# Altium schematic sheet OLD.SchDoc: Pinger
size A4; Date: 05/06/2020; CompanyName: AUVIC; DrawnBy: Aman Nijjar; Engineer: Aman Nijjar; Organization: AUVIC; DocumentNumber: 1; Revision: 3; SheetNumber: 1; SheetTotal: 1
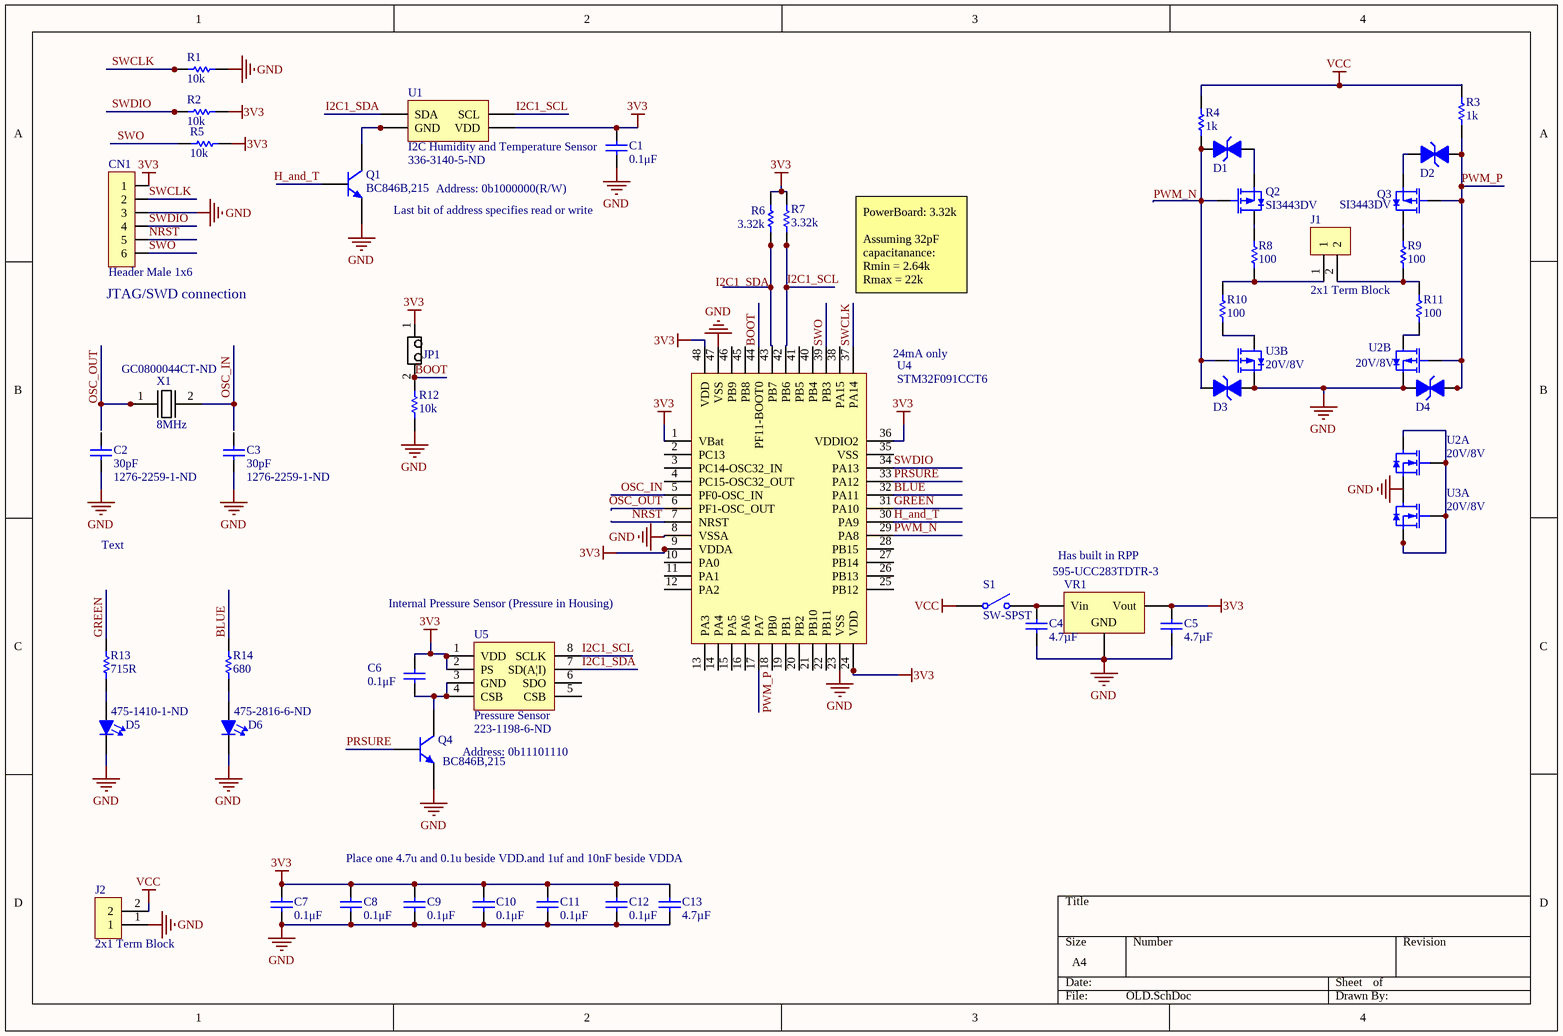
[diagram p0: OLD.SchDoc]

## Parts
C1  0.1μF  [CAPC1608N(0603")]
C2  30pF  Supplier Part Number 1: 1276-2259-1-ND  [CAPC1608N(0603")]
C3  30pF  Supplier Part Number 1: 1276-2259-1-ND  [CAPC1608N(0603")]
C4  4.7µF  [CAPC2012N(0805")]
C5  4.7µF  [CAPC2012N(0805")]
C6  0.1μF  [CAPC1608N(0603")]
C7  0.1μF  [CAPC1608N(0603")]
C8  0.1μF  [CAPC1608N(0603")]
C9  0.1μF  [CAPC1608N(0603")]
C10  0.1μF  [CAPC1608N(0603")]
C11  0.1μF  [CAPC1608N(0603")]
C12  0.1μF  [CAPC1608N(0603")]
C13  4.7µF  [CAPC2012N(0805")]
CN1  Header Male 1x6  [Header, Male, 1X6]
D1  SMBJ24CA  [DO-214AC]  (value not drawn)
D2  SMBJ24CA  [DO-214AC]  (value not drawn)
D3  SMBJ24CA  [DO-214AC]  (value not drawn)
D4  SMBJ24CA  [DO-214AC]  (value not drawn)
D5  Supplier Part Number 1: 475-1410-1-ND  [LED0805]  (hidden comment: Red)
D6  Supplier Part Number 1: 475-2816-6-ND  [LED0603]  (hidden comment: Blue)
J1  2x1 Term Block  [2X1 Terminal Blocks Phoenix Contact 5mm]
J2  2x1 Term Block  [2X1 Terminal Blocks]
JP1  1X2 Pin Head  [2X1 Males Header]  (value not drawn)
Q1  BC846B,215  [SOT-23]
Q2  SI3443DV  [SuperSOT-6]
Q3  SI3443DV  [SuperSOT-6]
Q4  BC846B,215  [SOT-23]
R1  10k  [RESC1608N(0603")]
R2  10k  [RESC1608N(0603")]
R3  1k  [RESC1608N(0603")]
R4  1k  [RESC1608N(0603")]
R5  10k  [RESC1608N(0603")]
R6  3.32k  [RESC1608N(0603")]
R7  3.32k  [RESC1608N(0603")]
R8  100  [RESC1608N(0603")]
R9  100  [RESC1608N(0603")]
R10  100  [RESC1608N(0603")]
R11  100  [RESC1608N(0603")]
R12  10k  [RESC1608N(0603")]
R13  715R  [RESC1608N(0603")]
R14  680  [RESC2012N(0805")]
S1  SW-SPST  [SPST-2]
U1  I2C Humidity and Temperature Sensor  Supplier Part Number 1: 336-3140-5-ND  [QFN-6]
U2  20V/8V  [SOT-363]  (parts A,B of 2)
U3  20V/8V  [SOT-363]  (parts A,B of 2)
U4  STM32F091CCT6  [STM-48LQFP]
U5  Pressure Sensor  Supplier Part Number 1: 223-1198-6-ND  [TE Pressure Sensor (MS560702BA03-50)]
VR1  595-UCC283TDTR-3  [D2PAK_N]
X1  8MHz  Supplier Part Number 1: GC0800044CT-ND  [HC49/US]

## Nets
3V3: C1.2(Cathode) C5.2(Cathode) C6.2(Cathode) C7.2(Cathode) C8.2(Cathode) C9.2(Cathode) C10.2(Cathode) C11.2(Cathode) C12.2(Cathode) C13.2(Cathode) CN1.1 JP1.1 R2.2 R5.2 R6.1 R7.1 U1.5(VDD) U4.1(VBat) U4.9(VDDA) U4.24(VDD) U4.36(VDDIO2) U4.48(VDD) U5.1(VDD) U5.2(PS) VR1.3(Vout)
GND: C1.1(Anode) C2.1 C3.1 C4.1(Anode) C5.1(Anode) C7.1(Anode) C8.1(Anode) C9.1(Anode) C10.1(Anode) C11.1(Anode) C12.1(Anode) C13.1(Anode) CN1.3 D3.2(Cathode) D4.2(Cathode) D5.1(Cathode) D6.1(Cathode) J2.1 Q1.2(E) Q4.2(E) R1.1 R12.1 U2.4(S2) U3.4(S2) U3.6(D1) U4.8(VSSA) U4.23(VSS) U4.47(VSS) VR1.2(GND)
VCC: J2.2 R3.2 R4.2 S1.1(COMMON)
BLUE: R14.2 U4.32(PA11)
BOOT: JP1.2 R12.2 U4.44(PF11-BOOT0)
GREEN: R13.2 U4.31(PA10)
H_and_T: Q1.1(B) U4.30(PA9)
I2C1_SCL: R7.2 U1.6(SCL) U4.42(PB6) U5.8(SCLK)
I2C1_SDA: R6.2 U1.1(SDA) U4.43(PB7) U5.7(SD(A|I))
NRST: CN1.5 U4.7(NRST)
OSC_IN: U4.5(PF0-OSC_IN) X1.2
OSC_OUT: U4.6(PF1-OSC_OUT) X1.1
PRSURE: Q4.1(B) U4.33(PA12)
PWM_N: D1.2(Cathode) D3.1(Anode) Q2.3 R4.1 U3.5(G2) U4.29(PA8)
PWM_P: D2.2(Cathode) D4.1(Anode) Q3.3 R3.1 U2.5(G2) U4.17(PA7)
SWCLK: CN1.2 R1.2 U4.37(PA14)
SWDIO: CN1.4 R2.1 U4.34(PA13)
SWO: CN1.6 R5.1 U4.39(PB3)
NetC4_2: C4.2(Cathode) S1.2(NO) VR1.1(Vin)
NetC6_1: C6.1(Anode) Q4.3(C) U5.3(GND) U5.4(CSB)
NetD1_1: D1.1(Anode) Q2.1
NetD2_1: D2.1(Anode) Q3.1
NetD5_2: D5.2(Anode) R13.1
NetD6_2: D6.2(Anode) R14.1
NetJ1_1: J1.1 R8.1 R10.2
NetJ1_2: J1.2 R9.1 R11.2
NetQ1_3: Q1.3(C) U1.2(GND)
NetQ2_4: Q2.4 R8.2
NetQ3_4: Q3.4 R9.2
NetR10_1: R10.1 U3.3(D2)
NetR11_1: R11.1 U2.3(D2)
NetU2_2: U2.2(G1) U2.6(D1) U3.1(S1) U3.2(G1)

Not connected (* = marked no-connect by the designer): C2 2; C3 2; U2 1(S1); U4 2(PC13) 3(PC14-OSC32_IN) 4(PC15-OSC32_OUT) 10(PA0) 11(PA1) 12(PA2) 13(PA3) 14(PA4) 15(PA5) 16(PA6) 18(PB0) 19(PB1) 20(PB2) 21(PB10) 22(PB11) 25(PB12) 26(PB13) 27(PB14) 28(PB15) 35(VSS) 38(PA15) 40(PB4) 41(PB5) 45(PB8) 46(PB9); U5 5(CSB) 6(SDO)

## Notes on the sheet
- Last bit of address specifies read or write
- Address: 0b1000000(R/W)
- (near CN1) JTAG/SWD connection
- PowerBoard: 3.32k
  Assuming 32pF capacitanance:
  Rmin = 2.64k
  Rmax = 22k
- (near U4) 24mA only
- Text
- Has built in RPP
- (near U4) Internal Pressure Sensor (Pressure in Housing)
- (near Q4) Address: 0b11101110
- Place one 4.7u and 0.1u beside VDD.and 1uf and 10nF beside VDDA

## Library data of the parts
C1 C6-C12 = 0.1uF 100V 0603 SMD, Ceramic: Capacitor, Ceramic, 100V, +/- 10%, 0603 SMD, X7R; MFG: TDK; MFG#: CGA3E3X7S2A104K080AB; Published: 16-04-26; Publisher: AUVic; PackageDescription: Chip Capacitor; Value: 0.1μF; Created By: Ashwin Sira; Supplier 1: Digi-Key; Supplier Part Number 1: 445-6938-1-ND
C2 C3 = 30pF 50V 0603 SMD, Ceramic: Capacitor, Ceramic, 50V, +/-1%, 0603 SMD, C0G; Made By: Andy Bates; Published: 16-09-12; Publisher: AUVic; PackageDescription: Chip Capacitor; Value: 30pF; Supplier 1: Digi-Key
C4 C5 C13 = 4.7uF 35V 0805 SMD, Ceramic: Capacitor, Ceramic, 35V, +/- 10%, 0805 SMD, X5R; Made By: Andy Bates; Published: 16-11-12; Publisher: AUVic; PackageDescription: Chip Capacitor; Value: 4.7µF; Supplier 1: Digi-Key; Supplier Part Number 1: 1276-6722-1-ND
CN1 = Header, Male, 1x6: 1x6, Pads Pitch: 0.1" (2.54mm), Through hole; Made Bates: Andy Bates; Supplier 1: Digikey; Supplier 1 Part Number: 952-2270-ND
D1-D4 = SMBJ24CA: TVS DIODE 24VWM 38.9VC SMB; Manufacturer: Fairchild Semiconductor; Type: Zener; Bidirectional Channels: 1; Voltage - Reverse Standoff (Typ): 24V; Voltage - Breakdown (Min): 26.7V; Voltage - Clamping (Max) @ Ipp: 38.9V; Current - Peak Pulse (10/1000µs): 15.4A; Power - Peak Pulse: 600W; Power Line Protection: No; Supplier 1: Digi-Key; Manufacturer Part Number: SMBJ24CA; RoHS: RoHS Compliant; Category: Circuit Protection; Stock 1: 31873; Pricing 1: 1=0.58, 10=0.411, 25=0.3372, 100=0.2695, 250=0.19636, 500=0.15946, 1000=0.12257 (USD); Packaging: Cut Tape (CT); Unidirectional Channels: -; Applications: General Purpose; Capacitance @ Frequency: -; Operating Temperature: -55°C ~ 150°C (TJ); Mounting Type: Surface Mount; Package / Case: DO-214AA, SMB; Supplier Device Package: DO-214AA (SMB); ComponentLink1URL: http://www.fairchildsemi.com/datasheets/SM/SMBJ100A.pdf; ComponentLink1Description: http://www.fairchildsemi.com/datasheets/SM/SMBJ100A.pdf; Supplier Part Number 1: SMBJ24CAFSCT-ND
D5 = LED, 0805 (2012), Green, Clear: Colour: Red; Created By: Andy Bates; Supplier 1: Digi-Key
D6 = LED, 0603 (1608), Blue, Clear: Colour: Blue; Created By: Lyden Smith; Date Created: 2017-09-19; Supplier 1: Digi-Key
J1 = 2x1 Terminal Block, 20A, 12-20AWG: Made by: Andy Bates; Date Made: 2017-11-14; Supplier 1: Digi-Key; Supplier Part Number 1: 277-6405-ND
J2 = 2x1 Terminal Block: Made by: Andy Bates; Supplier 1: Digikey; Supplier Part Number 1: ED2740-ND
JP1 = 1x2 Male Header: Made By: Andy Bates; Supplier 1: Digikey; Supplier Part Number 1: 952-3073-ND
Q1 Q4 = BC846B,215: NPN 65V 100mA 250mW; Published: 8-Jun-2000; LatestRevisionDate: 09-Sep-2016; DatasheetVersion: 1997; Publisher: Andy Bates; Supplier 1: Digi-Key; Supplier Part Number 1: 568-1632-1-ND
Q2 Q3 = SI3443DVFSTR-ND: P-Channel 20V 4A (Ta) 1.6W (Ta) Surface Mount SuperSOT™-6; ComponentLink1Description: Datasheet; ComponentLink1URL: *https://www.onsemi.com/pub/Collateral/SI3443DV-D.PDF; Supplier 1: Digi-Key
R1 R2 R5 R12 = 10kR, 1%, 1/10W, 0603 SMD: Made By: Ashwin Sira; Owned By: AUVic; Created On: 14-05-31; Last Edited: 14-05-31; Supplier 1: Digi-Key; Supplier Part Number 1: 311-10.0KHRCT-ND; Value: 10k
R3 R4 = 1kR, 1%, 1/10W , 0603, SMD: Created By: Andy Bates; Publisher: AUVic; Date Created: 2017-05-10; Value: 1k; Supplier 1: Digikey; Supplier Part Number 1: 311-1.00KHRCT-ND
R6 R7 = 3.32k, 1%, 1/10W, 0603, SMD: Created By: Ashwin Sira; Publisher: AUVic; Date Created: 2016-06-25; Value: 3.32k; Supplier 1: Digi-Key; Supplier Part Number 1: RMCF0603FT3K32CT-ND
R8-R11 = 100R, 1%, 1/10W, 0603 SMD: Made By: Andy Bates; Owned By: AUVic; Created On: 16-09-10; Last Edited: 16-09-10; Value: 100; Supplier 1: Digi-Key; Supplier Part Number 1: 311-100HRCT-ND
R13 = 715R, 1%, 1/10W, 0603, SMD: Created By: Ashwin Sira; Publisher: AUVic; Date Created: 2016-06-10; Value: 715R; Supplier 1: Digi-Key; Supplier Part Number 1: 541-715HCT-ND
R14 = 680, 5%, 1/8W, 0805 SMD: Value: 680; Created By: Lyden Smith; Created On: 2017-06-04; Supplier 1: Digi-Key; Supplier Part Number 1: RMCF0805JT680RCT-ND
S1 = SW-SPST: Single-Pole, Single-Throw Switch; Published: 24-Mar-1999; LatestRevisionDate: 17-Jul-2002; LatestRevisionNote: Re-released for DXP Platform.; PackageReference: SPST-2; Publisher: Altium Limited; PackageDescription: Switch; 2 Leads
U1 = Si700XX: Made by: Andy Bates; Supplier 1: Digi-Key; Created on: 2019/09/08
U2 U3 = NTJD4105CT1GOSTR-ND: Mosfet Array N and P-Channel 20V, 8V 630mA, 775mA 270mW Surface Mount SC-88/SC70-6/SOT-363; Supplier 1: Digi-Key; Supplier Part Number 1: NTJD4105CT1GOSCT-ND; ComponentLink1Description: Datasheet; ComponentLink1URL: https://www.onsemi.com/pub/Collateral/NTJD4105C-D.PDF
U4 = STM32F091CCT6: LQFP48 Chip; Made by: Andy Bates; Digikey Number: 497-15166-ND; Supplier 1: Digikey
U5 = MS560702BA03-50 Pressure Sensor: 1kPa to 120 kPa; Made by: Andy Bates; Created on: 2017-09-11; Supplier 1: Digi-Key
VR1 = Volt Reg: Voltage Regulator; Published: 24-Mar-1999; LatestRevisionDate: 29-May-2009; LatestRevisionNote: IPC-7351 Footprint Added.; PackageReference: D2PAK; Publisher: Altium Limited; PackageDescription: 3-Pin Transistor Outline Package 2.54 mm Pitch, 15.1 mm Lead Span
X1 = Oscillator 8MHz 40ESR: 8Mhz 40ESR  16pF -20°C ~ 70°C; Made By: Lyden Smith; Date Made: 2017-09-18; Supplier 1: Digi-Key